# Altium schematic sheet mcu.schdoc
size 209 x 297 mm; Scale: 1:1; DocumentType: Ñõåìà ýëåêòðè÷åñêàÿ ïðèíöèïèàëüíàÿ; FirstReferrence: ÀÁÂÃ.123456.001; Title1str: {Наименование}; PageSetup: Record=PageOptions¦CenterHorizontal=False¦CenterVertical=False¦PrintScale=0.95¦XCorrection=0.00¦YCorrection=0.00¦PrintKind=1¦BorderSize=5000000¦LeftOffset=0¦BottomOffset=0¦Orientation=1¦PaperLength=1000¦PaperWidth=1000¦Scale=100¦PaperSource=15¦PrintQuality=600¦MediaType=1¦DitherType=10¦PaperKind=A4¦PrintScaleMode=1; DocumentType1str: {Документ}; DocumentType2str: {Документ}
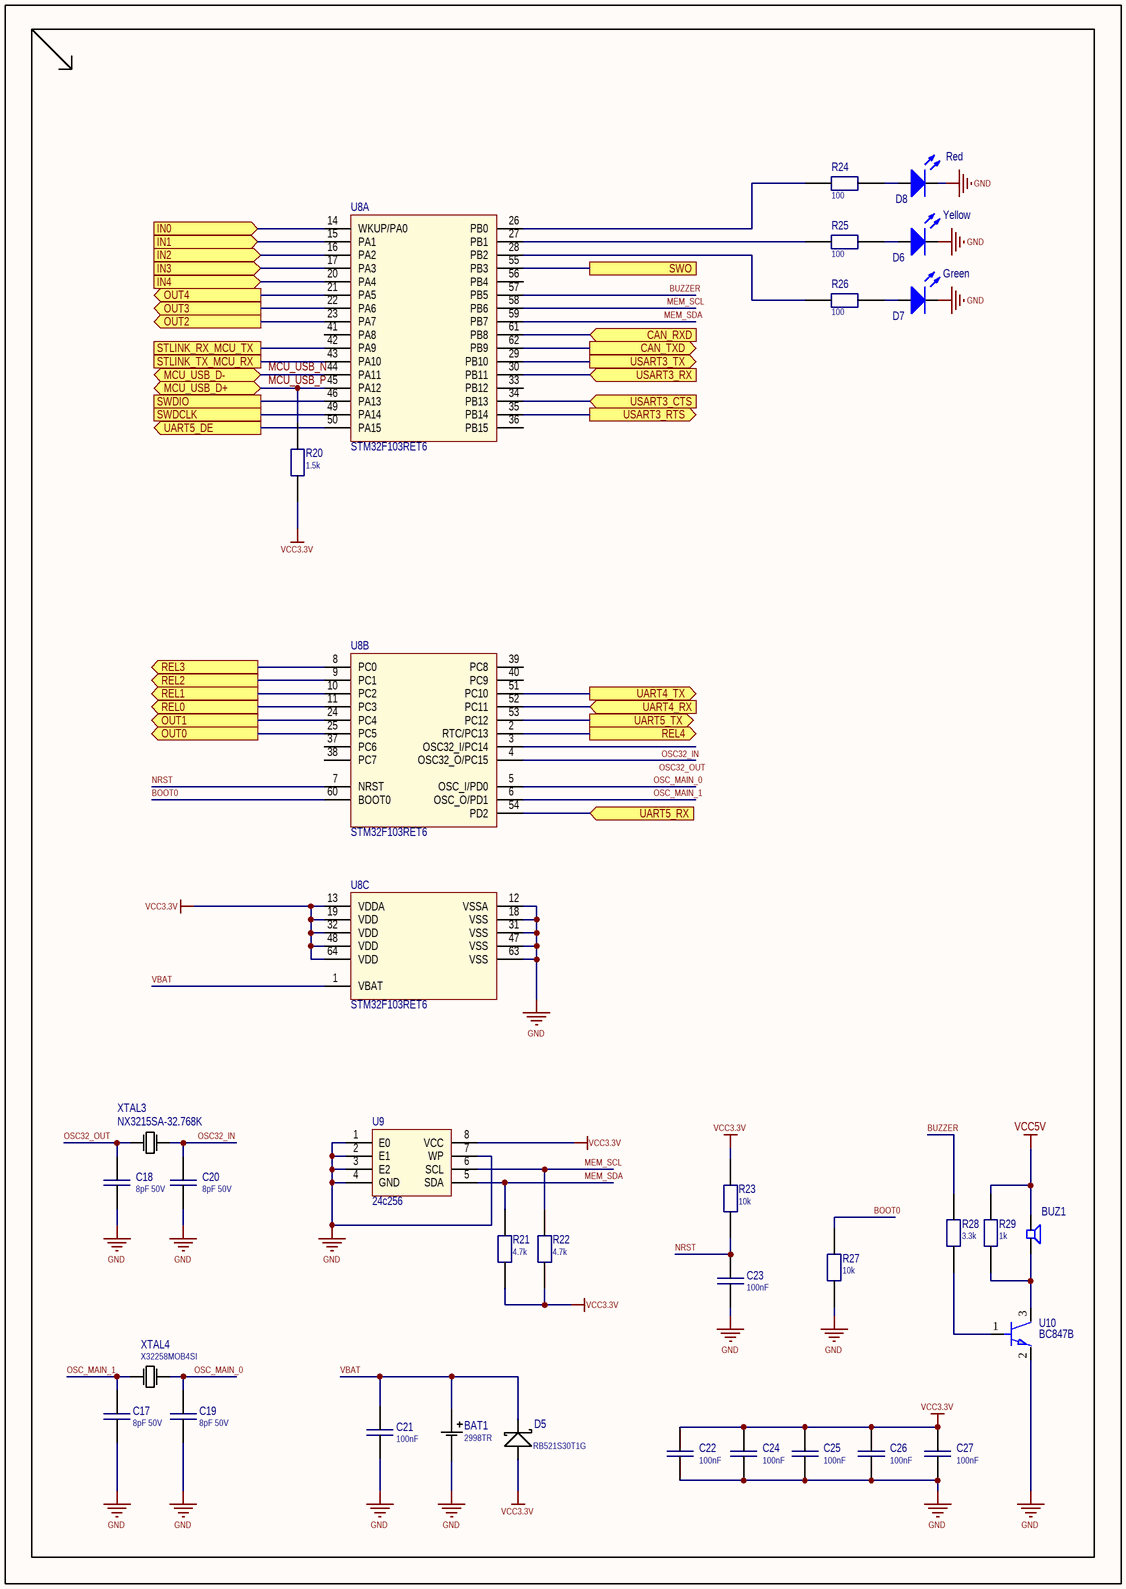
[diagram p0: mcu.schdoc]

## Parts
BAT1  2998TR  [BAT_2998TR]
BUZ1  L-KLS3-SMT-09X1.8  [SPKR_PKMCS0909E4000-R1]  (value not drawn)
C17  8pF 50V  [C_0603]
C18  8pF 50V  [C_0603]
C19  8pF 50V  [C_0603]
C20  8pF 50V  [C_0603]
C21  100nF  [C_0603]
C22  100nF  [C_0603]
C23  100nF  [C_0603]
C24  100nF  [C_0603]
C25  100nF  [C_0603]
C26  100nF  [C_0603]
C27  100nF  [C_0603]
D5  RB521S30T1G  [SOD-523]
D6  Yellow  [LED_1206]
D7  Green  [LED_1206]
D8  Red  [LED_1206]
R20  1.5k  [R_0603]
R21  4.7k  [R_0603]
R22  4.7k  [R_0603]
R23  10k  [R_0603]
R24  100  [R_0603]
R25  100  [R_0603]
R26  100  [R_0603]
R27  10k  [R_0603]
R28  3.3k  [R_0603]
R29  1k  [R_0603]
U8  STM32F103RET6  [LQFP64]  (parts A,B,C of 3)
U9  24c256  [SO-8_M]
U10  BC847B  [SOT23]
XTAL3  NX3215SA-32.768K  [XTAL_NX3215SA-32.768K-STD-MUA-8]
XTAL4  X32258MOB4SI  [NX3225GA]

## Ports
CAN_RXD (in), CAN_TXD (out), IN0 (in), IN1 (in), IN2 (in), IN3 (in), IN4 (in), MCU_USB_D+ (bidir), MCU_USB_D- (bidir), OUT0 (out), OUT1 (out), OUT2 (out), OUT3 (out), OUT4 (out), REL0 (out), REL1 (out), REL2 (out), REL3 (out), REL4 (out), STLINK_RX_MCU_TX, STLINK_TX_MCU_RX, SWDCLK, SWDIO, SWO, UART4_RX (in), UART4_TX (out), UART5_DE (out), UART5_RX (in), UART5_TX (out), USART3_CTS (in), USART3_RTS (out), USART3_RX (in), USART3_TX (out)

## Nets
GND: BAT1.N(-) C17.1 C18.1 C19.1 C20.1 C21.1 C22.1 C23.1 C24.1 C25.1 C26.1 C27.1 D6.2(K) D7.2(K) D8.2(K) R27.1 U8.12(VSSA) U8.18(VSS) U8.31(VSS) U8.47(VSS) U8.63(VSS) U9.1(E0) U9.2(E1) U9.3(E2) U9.4(GND) U9.7(WP) U10.2
VCC3.3V: C22.2 C24.2 C25.2 C26.2 C27.2 D5.2(A) R20.2 R21.2 R22.2 R23.2 U8.13(VDDA) U8.19(VDD) U8.32(VDD) U8.48(VDD) U8.64(VDD) U9.8(VCC)
VCC5V: BUZ1.1 R29.2
BOOT0: R27.2 U8.60(BOOT0)
BUZZER: R28.1 U8.57(PB5)
CAN_RXD: U8.61(PB8) ; port CAN_RXD
CAN_TXD: U8.62(PB9) ; port CAN_TXD
IN0: U8.14(WKUP/PA0) ; port IN0
IN1: U8.15(PA1) ; port IN1
IN2: U8.16(PA2) ; port IN2
IN3: U8.17(PA3) ; port IN3
IN4: U8.20(PA4) ; port IN4
MCU_USB_N: U8.44(PA11) ; port MCU_USB_D-
MCU_USB_P: R20.1 U8.45(PA12) ; port MCU_USB_D+
MEM_SCL: R22.1 U8.58(PB6) U9.6(SCL)
MEM_SDA: R21.1 U8.59(PB7) U9.5(SDA)
NRST: C23.2 R23.1 U8.7(NRST)
OSC32_IN: C20.2 U8.3(OSC32_I/PC14) XTAL3.2(OSC2)
OSC32_OUT: C18.2 U8.4(OSC32_O/PC15) XTAL3.1(OSC1)
OSC_MAIN_0: C19.2 U8.5(OSC_I/PD0) XTAL4.3(OSC2)
OSC_MAIN_1: C17.2 U8.6(OSC_O/PD1) XTAL4.1(OSC1)
OUT0: U8.25(PC5) ; port OUT0
OUT1: U8.24(PC4) ; port OUT1
OUT2: U8.23(PA7) ; port OUT2
OUT3: U8.22(PA6) ; port OUT3
OUT4: U8.21(PA5) ; port OUT4
REL0: U8.11(PC3) ; port REL0
REL1: U8.10(PC2) ; port REL1
REL2: U8.9(PC1) ; port REL2
REL3: U8.8(PC0) ; port REL3
REL4: U8.2(RTC/PC13) ; port REL4
STLINK_RX_MCU_TX: U8.42(PA9) ; port STLINK_RX_MCU_TX
STLINK_TX_MCU_RX: U8.43(PA10) ; port STLINK_TX_MCU_RX
SWDCLK: U8.49(PA14) ; port SWDCLK
SWDIO: U8.46(PA13) ; port SWDIO
SWO: U8.55(PB3) ; port SWO
UART4_RX: U8.52(PC11) ; port UART4_RX
UART4_TX: U8.51(PC10) ; port UART4_TX
UART5_DE: U8.50(PA15) ; port UART5_DE
UART5_RX: U8.54(PD2) ; port UART5_RX
UART5_TX: U8.53(PC12) ; port UART5_TX
USART3_CTS: U8.34(PB13) ; port USART3_CTS
USART3_RTS: U8.35(PB14) ; port USART3_RTS
USART3_RX: U8.30(PB11) ; port USART3_RX
USART3_TX: U8.29(PB10) ; port USART3_TX
VBAT: BAT1.P1(+) C21.2 D5.1(K) U8.1(VBAT)
NetBUZ1_2: BUZ1.2 R29.1 U10.3
NetD6_1: D6.1(A) R25.1
NetD7_1: D7.1(A) R26.1
NetD8_1: D8.1(A) R24.1
NetR24_2: R24.2 U8.26(PB0)
NetR25_2: R25.2 U8.27(PB1)
NetR26_2: R26.2 U8.28(PB2)
NetR28_2: R28.2 U10.1

Not connected (* = marked no-connect by the designer): U8 33(PB12) 36(PB15) 37(PC6) 38(PC7) 39(PC8) 40(PC9) 41(PA8) 56(PB4)

## Library data of the parts
BAT1 = 2998TR: Battery; Part Number: 2998TR
BUZ1 = BUZZER: Piezoelectric Sounders; Alternative Part: PKMCS0909E4000-R1; Part Number: L-KLS3-SMT-09X1.8
C17-C20 = C0603: Capacitor; Part Number: CC0603DRNPO9BN8R0; Value: 8pF 50V
C21-C27 = C0603: Capacitor; Part Number: CC0603JPX7R9BB104; Value: 100nF
D5 = D_SOD523: Diode; Part Number: RB521S30T1G; Alternative Part: *
D6 = LED_SMT_1206: Typical INFRARED GaAs LED; Part Number: KPT-3216SYC; Value: *; Color: Yellow
D7 = LED_SMT_1206: Typical INFRARED GaAs LED; Part Number: KP-3216SGD; Value: *; Color: Green
D8 = LED_SMT_1206: Typical INFRARED GaAs LED; Part Number: KP-3216SRD; Value: *; Color: Red
R20 = RES_SMD: Resistor; Part Number: RC0603FR-071K5L; Alternative Part: *; Value: 1.5k
R21 R22 = RES_SMD: Resistor; Part Number: RC0603FR-074K7L; Alternative Part: *; Value: 4.7k
R23 R27 = RES_SMD: Resistor; Part Number: RC0603FR-0710KL; Alternative Part: *; Value: 10k
R24-R26 = RES_SMD: Resistor; Part Number: RC0603FR-07100RL; Alternative Part: *; Value: 100
R28 = RES_SMD: Resistor; Part Number: RC0603FR-073K3L; Alternative Part: *; Value: 3.3k
R29 = RES_SMD: Resistor; Part Number: RC0603FR-071KL; Alternative Part: *; Value: 1k
U8 = STM32F103Rxx: High-density performance line Arm®-based 32-bit MCU with 256 to 512KB / Flash, USB, CAN, 11 timers, 3 ADCs, 13 communication interfaces; Part Number: STM32F103RET6
U9 = 24c256: 256-Kbit I2C-compatible Serial EEPROM; Part Number: AT24C256C
U10 = BC847B: 45V 200mW 200@2mA,5V 100mA NPN SOT-23-3 Bipolar (BJT); Part Number: BC847B
XTAL3 = NX3215SA-32.768K: Crystal Oscillator; Part Number: NX3215SA-32.768K-10PPM-45KOHM-6PF; Alternative Part: *
XTAL4 = NX3225GA: Crystal Oscillator; Part Number: X32258MOB4SI; Alternative Part: *